# EAGLE design TS (EAGLE 5.11)
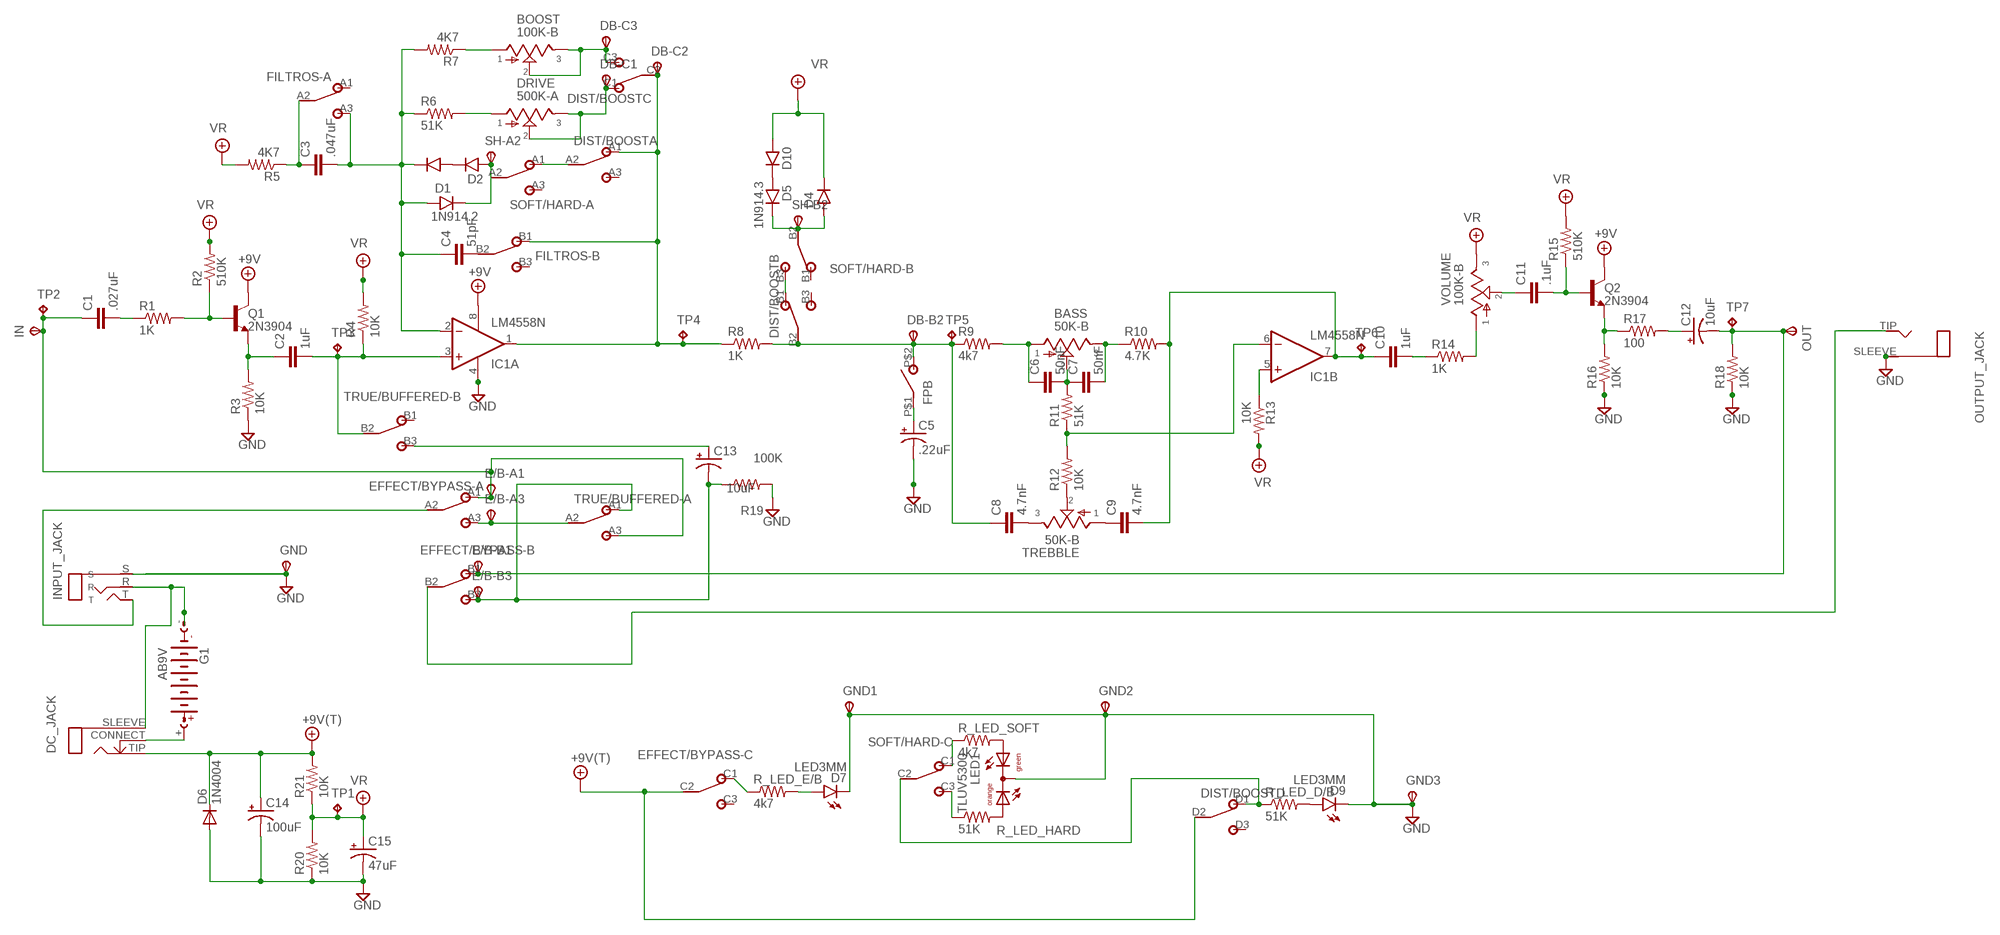
[diagram p0: schematic, sheet 1]

## Parts
+9V1  +9V(T)  [PAD]
+9V2  +9V(T)  [PAD]
BASS  50K-B  PAD_HOLE  [PAD_HOLE]
BOOST  100K-B  PAD_HOLE  [PAD_HOLE]
C1  .027uF  075X0352  [075X035]
C2  1uF  072X0352  [072X035]
C3  .047uF  075X0402  [075X040]
C4  51pF  050X030_0252  [050X030_025_2]
C5  .22uF  044A1  [044A]
C6  50nF  072X0252  [072X025]
C7  50nF  072X0252  [072X025]
C8  4.7nF  072X0252  [072X025]
C9  4.7nF  072X0252  [072X025]
C10  1uF  072X0352  [072X035]
C11  .1uF  072X0352  [072X035]
C12  10uF  0501  [050_020_1]
C13  10uF  0501  [050_020_1]
C14  100uF  0631  [063_025]
C15  47uF  0631  [063_025]
D1  1N914.2  [DO35-2]
D2  1N914.2  [DO35-2]
D3  1N914.2  [DO35-2]
D4  1N914.3  [DO35-3]
D5  1N914.3  [DO35-3]
D6  1N4004  1N400X.3  [DO41-3]
D7  LED3MM  [LED3MM]
D9  LED3MM  [LED3MM]
D10  1N914.3  [DO35-3]
DB-B2  CABLE  [CABLE]
DB-C1  CABLE  [CABLE]
DB-C2  CABLE  [CABLE]
DB-C3  CABLE  [CABLE]
DC_JACK  CLOSEDMONO  [CLOSED_MONO_JACK]
DIST/BOOST  4PDT  [4PDT]
DRIVE  500K-A  PAD_HOLE  [PAD_HOLE]
E/B-A1  CABLE  [CABLE]
E/B-A3  CABLE  [CABLE]
E/B-B1  CABLE  [CABLE]
E/B-B3  CABLE  [CABLE]
EFFECT/BYPASS-  3PDT  [3PDT]
FILTROS-  DPDT  [DPDT]
FPB  SPST  [SPST-PAD]
G1  AB9V  [AB9V]
GND  CABLE  [CABLE]
GND1  CABLE  [CABLE]
GND2  CABLE  [CABLE]
GND3  CABLE  [CABLE]
IC1  LM4558N  [DIL08]
IN  CABLE  [CABLE]
INPUT_JACK  STEREO  [STEREO_JACK]
LED1  TLUV5300  [TLUV5300]
OUT  CABLE  [CABLE]
OUTPUT_JACK  MONO  [MONO_JACK]
Q1  2N3904  [TO92-]
Q2  2N3904  [TO92-]
R1  1K  6MM.3  [R0207/3]
R2  510K  6MM.3  [R0207/3]
R3  10K  6MM.3  [R0207/3]
R4  10K  6MM.3  [R0207/3]
R5  4K7  6MM.3  [R0207/3]
R6  51K  6MM.3  [R0207/3]
R7  4K7  6MM.3  [R0207/3]
R8  1K  6MM.3  [R0207/3]
R9  4k7  6MM.3  [R0207/3]
R10  4.7K  6MM.3  [R0207/3]
R11  51K  6MM.3  [R0207/3]
R12  10K  6MM.3  [R0207/3]
R13  10K  6MM.3  [R0207/3]
R14  1K  6MM.3  [R0207/3]
R15  510K  6MM.3  [R0207/3]
R16  10K  6MM.3  [R0207/3]
R17  100  6MM.3  [R0207/3]
R18  10K  6MM.3  [R0207/3]
R19  100K  6MM.3  [R0207/3]
R20  10K  6MM.3  [R0207/3]
R21  10K  6MM.3  [R0207/3]
R_LED_D/B  51K  6MM.3  [R0207/3]
R_LED_E/B  4k7  6MM.3  [R0207/3]
R_LED_HARD  51K  6MM.3  [R0207/3]
R_LED_SOFT  4k7  6MM.3  [R0207/3]
SH-A2  CABLE  [CABLE]
SH-B2  CABLE  [CABLE]
SOFT/HARD-  3PDT  [3PDT]
TP1  TPTP11R  [TP11R]
TP2  TPTP11R  [TP11R]
TP3  TPTP11R  [TP11R]
TP4  TPTP11R  [TP11R]
TP5  TPTP11R  [TP11R]
TP6  TPTP11R  [TP11R]
TP7  TPTP11R  [TP11R]
TREBBLE  50K-B  PAD_HOLE  [PAD_HOLE]
TRUE/BUFFERED-  DPDT  [DPDT]
VOLUME  100K-B  PAD_HOLE  [PAD_HOLE]

## Nets
+9V: +9V1.P$3(+9V) +9V2.P$3(+9V) C14.+ D6.C DC_JACK.TIP DIST/BOOST.D2 EFFECT/BYPASS-.C2 IC1.8(P:V+) Q1.1(C) Q2.1(C) R21.2
GND: C5.2(-) C14.- C15.- D6.A D7.K(C) D9.K(C) GND1.P$3(PP) GND2.P$3(PP) GND3.P$3(PP) GND.P$3(PP) IC1.4(P:V-) INPUT_JACK.S LED1.CC OUTPUT_JACK.SLEEVE R3.1 R16.1 R18.1 R19.2 R20.1
N$1: D1.C D2.A SH-A2.P$3(PP) SOFT/HARD-.A2
N$2: C3.2 C4.1 D1.A D3.C FILTROS-.A3 IC1.2(A:-IN) R6.1 R7.2
N$3: C4.2 FILTROS-.B2
N$4: DIST/BOOST.A2 SOFT/HARD-.A1
N$5: DIST/BOOST.B1 SOFT/HARD-.B3
N$6: D4.A D5.C SH-B2.P$3(PP) SOFT/HARD-.B2
N$7: C13.+ TRUE/BUFFERED-.B3
N$8: DRIVE.P1 R6.2
N$9: EFFECT/BYPASS-.B2 OUTPUT_JACK.TIP
N$10: IC1.5(B:+IN) R13.1
N$11: C3.1 FILTROS-.A2 R5.1
N$12: R12.1 TREBBLE.P2
N$13: BASS.P2 C6.2 C7.1 R11.2
N$14: C8.2 TREBBLE.P3
N$15: C10.2 R14.1
N$16: R14.2 VOLUME.P1
N$17: C9.1 TREBBLE.P1
N$18: BASS.P1 C6.1 R9.2
N$19: BASS.P3 C7.2 R10.1
N$20: IC1.6(B:-IN) R11.1 R12.2
N$21: C9.2 C10.1 IC1.7(B:OUT) R10.2 TP6.TP
N$22: D2.C D3.A
N$23: C13.- E/B-B3.P$3(PP) EFFECT/BYPASS-.B3 R19.1 TRUE/BUFFERED-.A1
N$24: DC_JACK.CONNECT G1.+
N$25: C2.1 Q1.3(E) R3.2
N$26: R_LED_HARD.1 SOFT/HARD-.C3
N$27: DC_JACK.SLEEVE(RING) G1.- INPUT_JACK.R
N$28: C1.2 R1.1
N$29: Q1.2(B) R1.2 R2.1
N$30: C2.2 IC1.3(A:+IN) R4.1 TP3.TP TRUE/BUFFERED-.B2
N$31: Q2.3(E) R16.2 R17.1
N$32: C11.2 Q2.2(B) R15.1
N$33: C12.+ R17.2
N$34: C11.1 VOLUME.P2
N$35: EFFECT/BYPASS-.A2 INPUT_JACK.T
N$36: LED1.AG R_LED_SOFT.2
N$37: E/B-A3.P$3(PP) EFFECT/BYPASS-.A3 TRUE/BUFFERED-.A2
N$38: C12.- E/B-B1.P$3(PP) EFFECT/BYPASS-.B1 OUT.P$3(PP) R18.2 TP7.TP
N$39: C1.1 E/B-A1.P$3(PP) EFFECT/BYPASS-.A1 IN.P$3(PP) TP2.TP TRUE/BUFFERED-.A3
N$40: EFFECT/BYPASS-.C1 R_LED_E/B.1
N$41: D7.A R_LED_E/B.2
N$42: C5.1(+) FPB.P$1(P)
N$43: LED1.AO R_LED_HARD.2
N$44: D9.A R_LED_D/B.2
N$45: DIST/BOOST.D1 R_LED_D/B.1 SOFT/HARD-.C2
N$46: R_LED_SOFT.1 SOFT/HARD-.C1
N$48: D5.A D10.C
N$49: C8.1 DB-B2.P$3(PP) DIST/BOOST.B2 FPB.P$2(S) R8.2 R9.1 TP5.TP
N$50: DB-C2.P$3(PP) DIST/BOOST.A1 DIST/BOOST.C2 FILTROS-.B1 IC1.1(A:OUT) R8.1 TP4.TP
N$51: BOOST.P1 R7.1
N$52: BOOST.P2 BOOST.P3 DB-C3.P$3(PP) DIST/BOOST.C3
N$53: DB-C1.P$3(PP) DIST/BOOST.C1 DRIVE.P2 DRIVE.P3
VR: C15.+ D4.C D10.A R2.2 R4.2 R5.2 R13.2 R15.2 R20.2 R21.1 TP1.TP VOLUME.P3
Unconnected: DIST/BOOST.A3 DIST/BOOST.B3 DIST/BOOST.D3 EFFECT/BYPASS-.C3 FILTROS-.A1 FILTROS-.B3 SOFT/HARD-.A3 SOFT/HARD-.B1 TRUE/BUFFERED-.B1

## Library data of the parts
+9V1 +9V2 = gm-supply:+9V(T): +9V Voltage Supply use this to hook up +9v throughout a schematic instead of running wire automatically labels the net "+9v" adds a hookup pad to the circuit board
BASS BOOST DRIVE TREBBLE VOLUME = Miguel:PAD_HOLE
C1 = gm-caps-film-chicklet:075X035: 0.027 - 0.033uF Panasonic ECQ-B 7mm x 4mm 50 or 63V: 0.027 - 0.033uF;
C2 C10 C11 = gm-caps-film-box:072X035: 0.15 - 1.0uF; WIMA MKP2 63, 100V: 0.047uF; MKS2 50V: 0.68 - 1.0uF; 63V: 0.33 - 0.47uF; 100V: 0.15 - 0.22uF;
C3 = gm-caps-film-chicklet:075X040: 0.039 - 0.047uF Panasonic ECQ-B 7mm x 4mm 50V: 0.039 - 0.047uF;
C4 = gm-caps-ceramic:050X030_025: 47 - 120pF Xicon Ceramic Disc 2.5mm lead spacing
C5 = gm-caps-tant:044A: .1 - 1.5µF Vishay Sprague Tantalex Long/Short (Case Code A); 4.4mm; 0.1" lead spacing
C6-C9 = gm-caps-film-box:072X025: 1000pF - 0.47uF WIMA MKP2 63, 100V: 1000pF - 0.015uF; MKS2 50V: 0.33 - 0.47uF; 63V: 1000pF - 0.22uF;
C12 C13 = gm-caps-electro-pol:050: 0.22 - 100uF Xicon values at Mouser.com: 10V: 10 - 100uF; 16V: 2.2 - 47uF; 25V: 0.47 - 47uF; 50V: 0.22 - 22uF
C14 C15 = gm-caps-electro-pol:063: 33 - 220uF Xicon values at Mouser.com 10V: 220uF; 16V: 100uF; 25V: 100uF; 50V: 33uF
D1-D5 D10 = gm-diodes:1N914: Fast Switching Diode DO-35 glass case a.k.a. 1N4148
D6 = gm-diodes:1N400X: Rectifier Diodes - often used in power supply to prevent damage from reverse polarization
D7 D9 = gm-diodes:LED
DB-B2 DB-C1-DB-C3 E/B-A1 E/B-A3 E/B-B1 E/B-B3 GND GND1-GND3 IN OUT SH-A2 SH-B2 = Miguel:CABLE
DC_JACK = gm-jacks:CLOSEDMONO: Closed Mono 1/4" Phone Jack
DIST/BOOST = gm-switches:4PDT
EFFECT/BYPASS- SOFT/HARD- = gm-switches:3PDT
FILTROS- TRUE/BUFFERED- = gm-switches:DPDT
FPB = gm-switches:SPST
G1 = gm-supply:AB9V: 9-V BATTERY CLIP
IC1 = gm-ics:*4558: *4558 Op Amp Infamous for its use in tube screamers. This op amp has many manufacturers, hence the leading "*" in the name. The JRC4558 is a widely used example.
INPUT_JACK = gm-jacks:STEREO: Stereo (TRS) 1/4" Phone Jack often use for the input jack to disconnect battery when there is no plug in the jack also called TRS or tip-ring-sleeve jack
LED1 = led:TLUV5300: Bicolor LED 5 mm Untinted Diffused Package Source: www.vishay.com .. Bi-Color LED Vashay TLUV5300.pdf
OUTPUT_JACK = gm-jacks:MONO: Mono 1/4" Phone Jack
Q1 Q2 = gm-trans:2N3904: NPN Transistor
R1-R21 R_LED_D/B R_LED_E/B R_LED_HARD R_LED_SOFT = gm-resistors:6MM: 6mm Resistors Leads spaced 1-6 holes apart for 0.1" perfboard. Suitable for 1/4 watt resistors.
TP1-TP7 = testpad:TP: Test pad

## Board
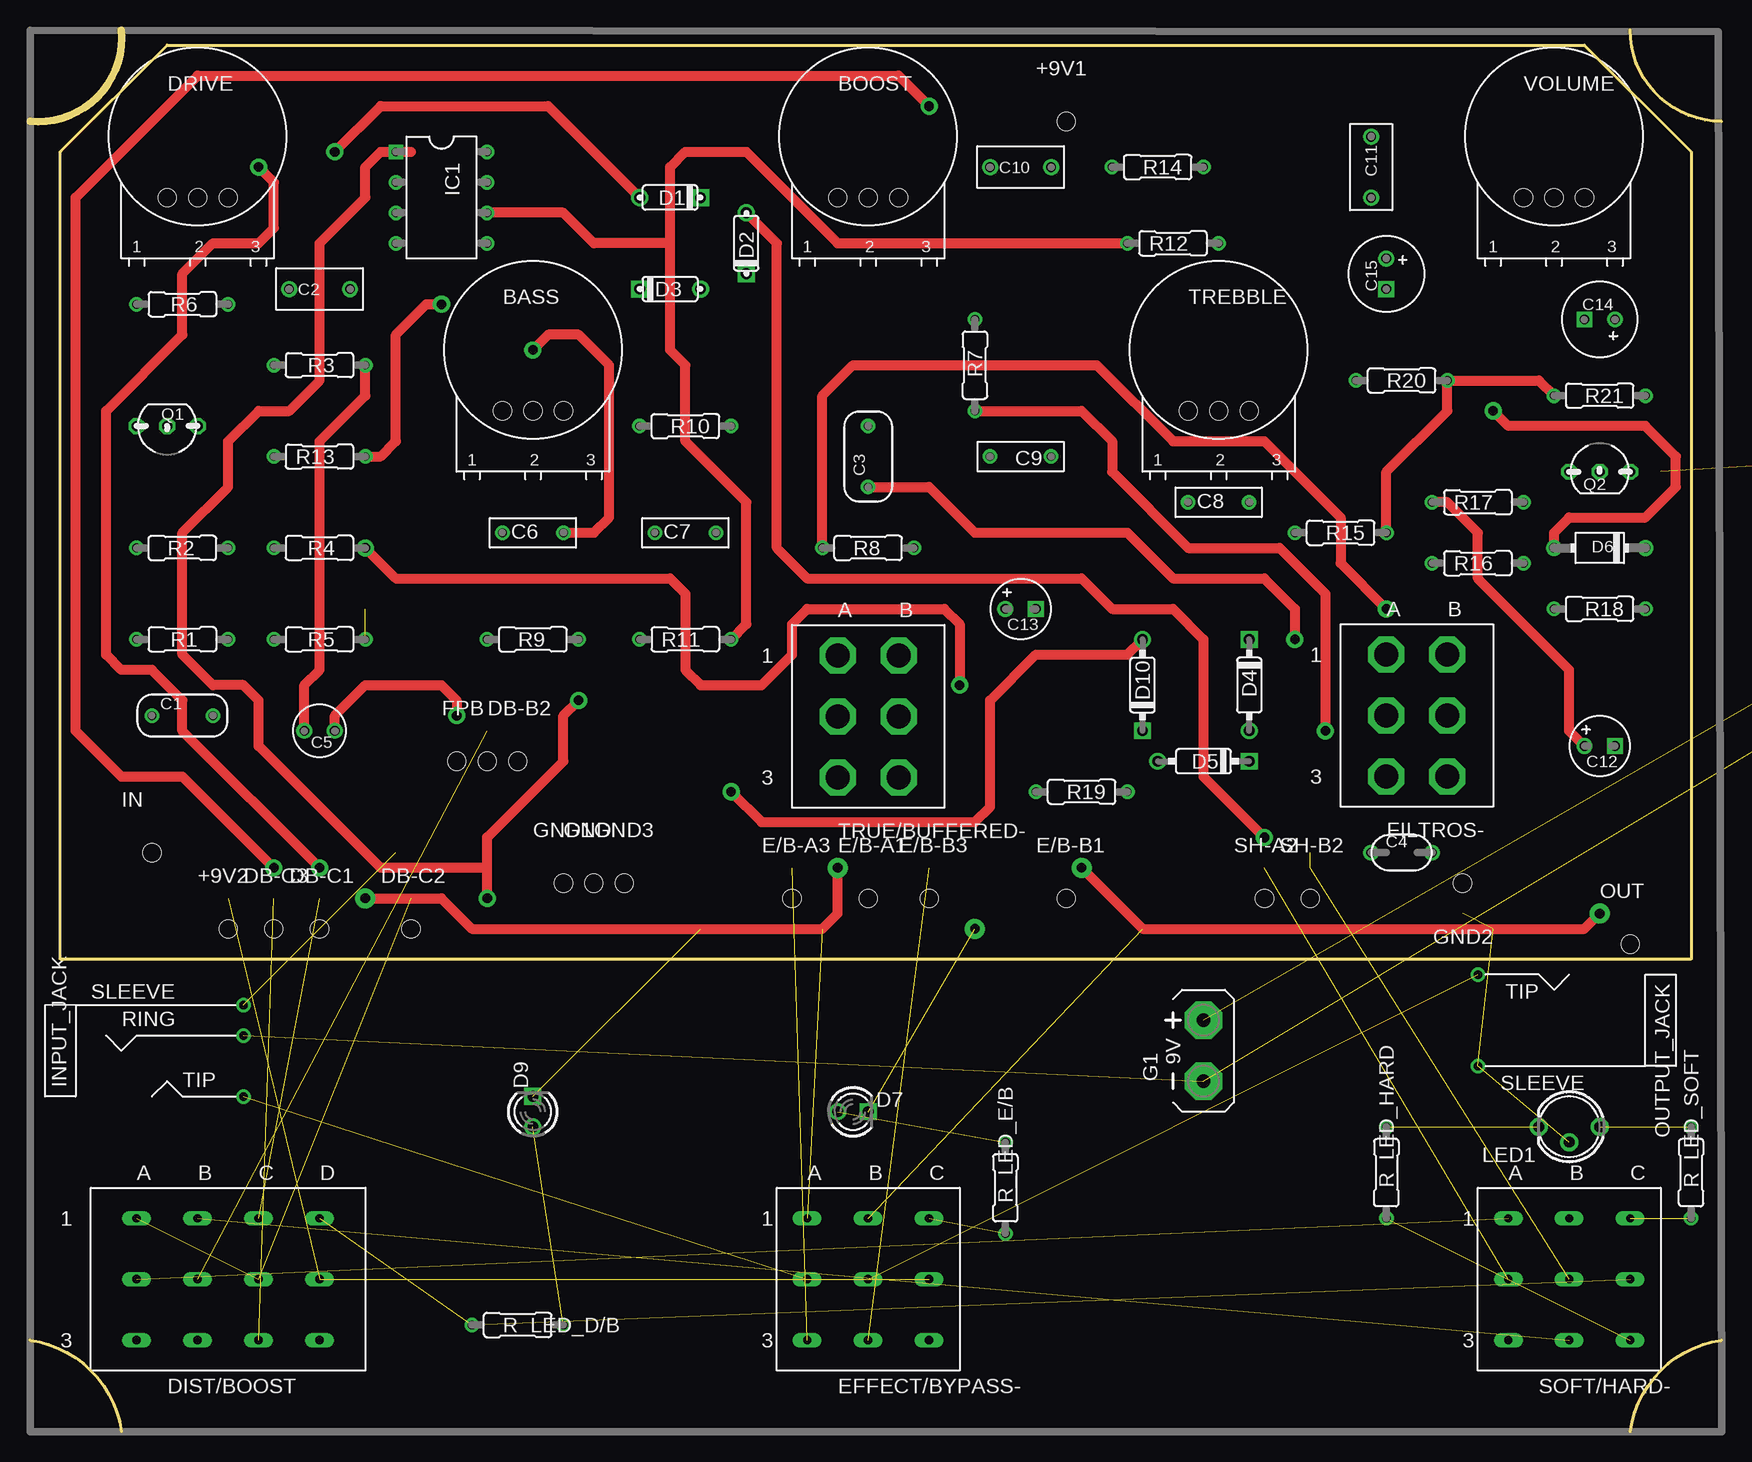
[diagram p1: board, top side]
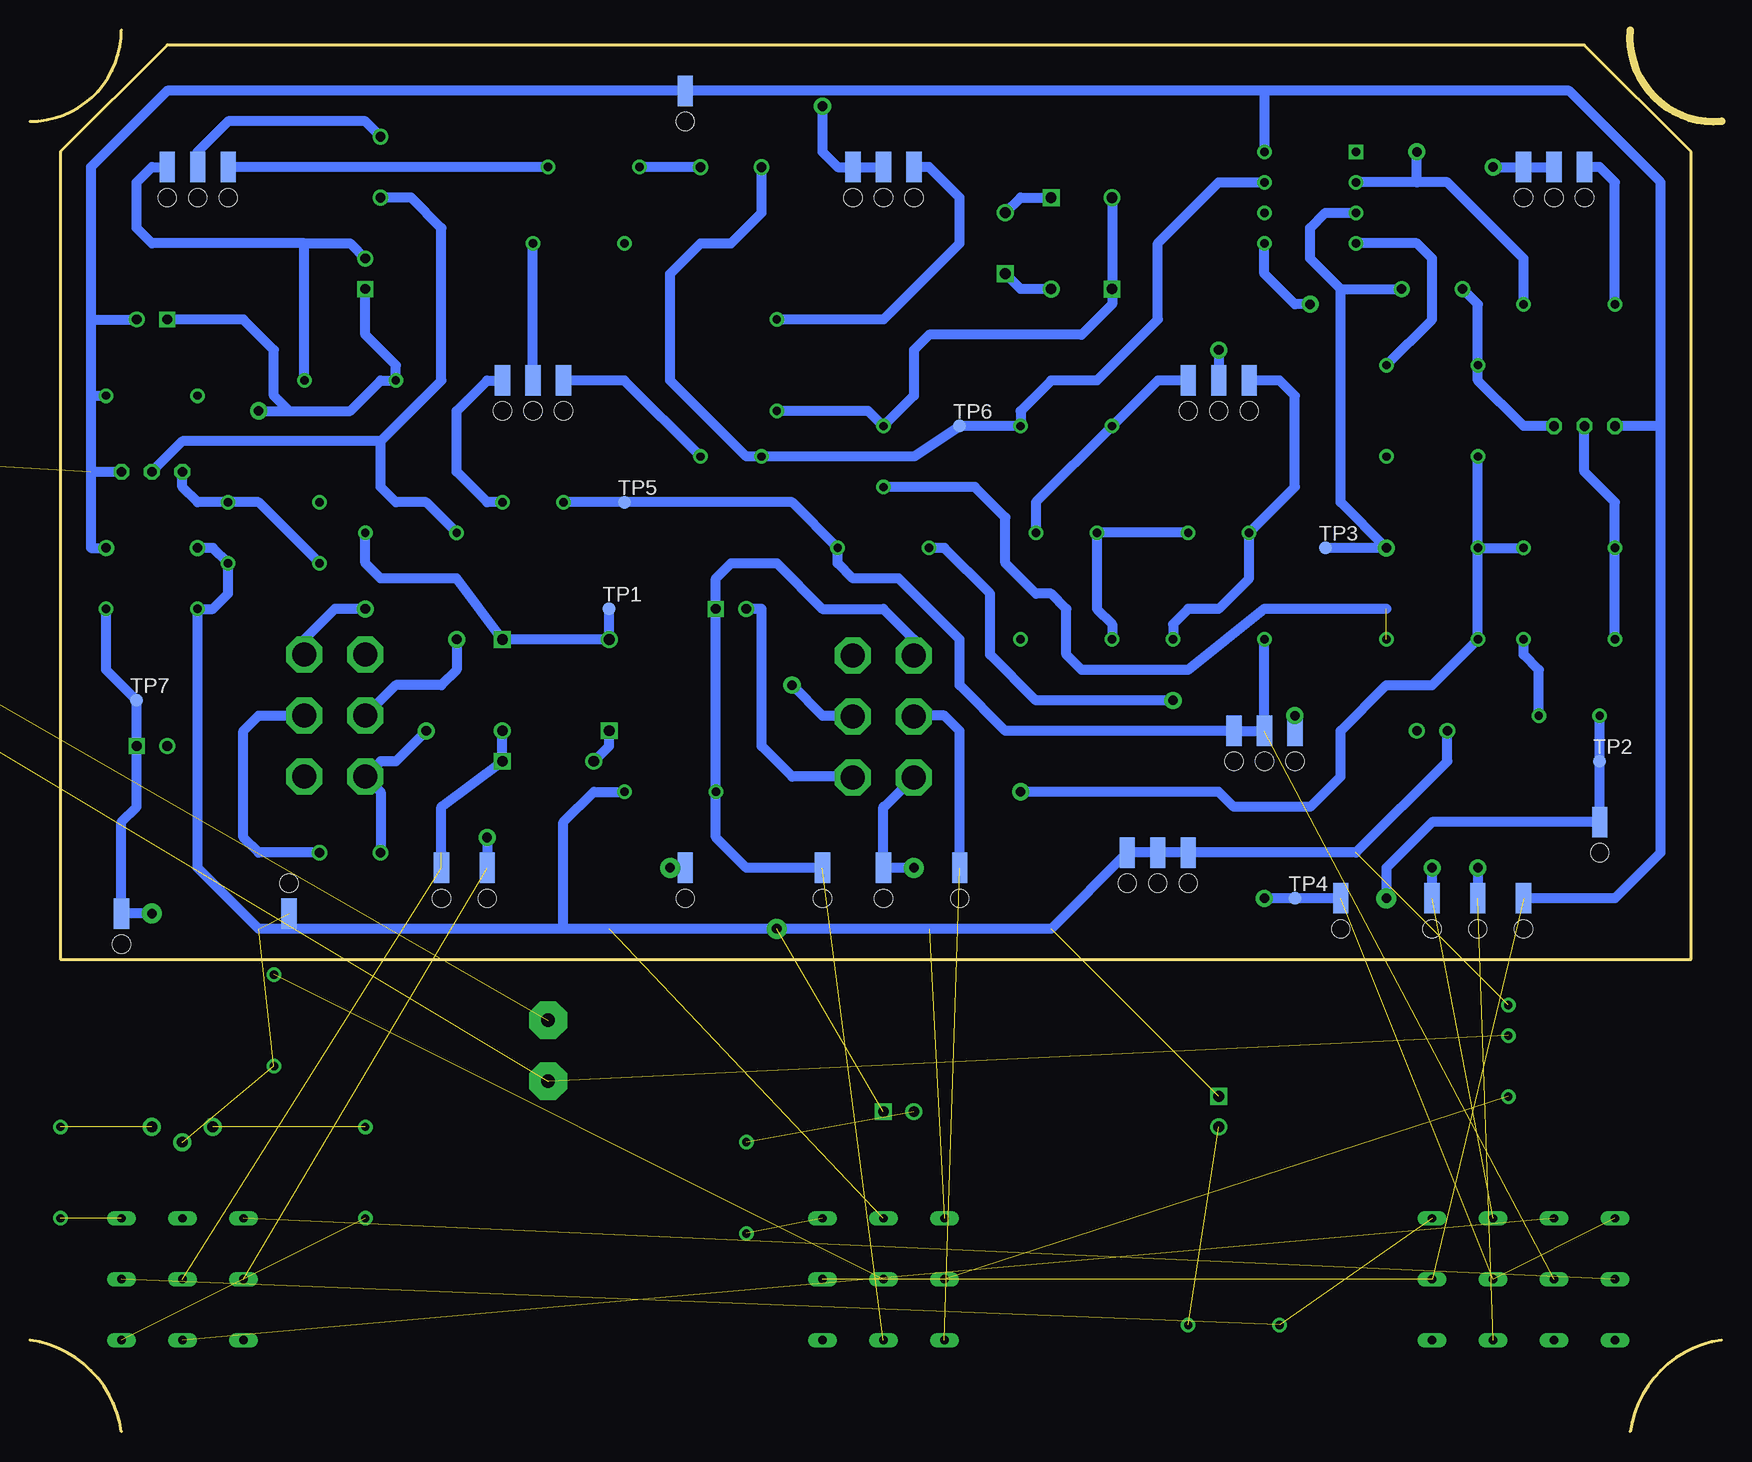
[diagram p2: board, bottom side, seen from below]

Size 140.97 x 116.84 mm. Coordinates in mm from the lower left corner, seen from the top.
Outline: 7.62,116.84 arc-100 0,109.22
Outline: 140.97,109.22 arc-90 133.35,116.84
Outline: 0,7.62 arc-74 7.62,0
Outline: 133.35,0 arc-74 140.97,7.62
Outline: 2.54,39.37 2.54,106.68 11.43,115.57 129.54,115.57 138.43,106.68 138.43,39.37 2.54,39.37
Copper layers (1*16): Top 0.035mm / dielectric 1.5mm / Bottom 0.035mm
Design rules "default": minimum track width 10mil, minimum drill 24mil, track to track 8mil, track to pad 8mil, pad to pad 8mil, via to via 8mil, smd to smd 8mil, copper to edge 40mil, drill to drill 8mil, minimum pad ring 10mil, minimum via ring 8mil, stop-mask expansion 4mil, vias tented up to drill 0mil, thermal gap 10mil

### Footprints (pad centres in the part's own frame; a part is rotated, then mirrored left to right if it is on the bottom)
PAD = smd 1.27 x 2.54 bottom: P$3 0,2.54 | hole 1.5: 0,0
PAD_HOLE = smd 1.27 x 2.54 bottom: P1 -2.54,-2.54; P2 0,-2.54; P3 2.54,-2.54 | hole 1.5: -2.54,-5.08; 0,-5.08; 2.54,-5.08
075X035 = drill 0.7 round: 1 -2.54,0; 2 2.54,0
072X035 = drill 0.813 round: 1 -2.54,0; 2 2.54,0
075X040 = drill 0.7 round: 1 -2.54,0; 2 2.54,0
050X030_025_2 = drill 0.8 round: 1 -2.54,0; 2 2.54,0
044A = drill 0.8 round: 1 -1.27,0; 2 1.27,0
072X025 = drill 0.7 round: 1 -2.54,0; 2 2.54,0
050_020_1 = drill 0.813 round: + -1.27,0 | drill 0.813 square: - 1.27,0
063_025 = drill 0.813 round: + -1.27,0 | drill 0.813 square: - 1.27,0
DO35-2 = drill 0.9 round: A 2.54,0 | drill 0.9 square: C -2.54,0
DO35-3 = drill 0.9 round: A 3.81,0 | drill 0.9 square: C -3.81,0
DO41-3 = drill 0.8 round: A 3.81,0; C -3.81,0
LED3MM = drill 0.9 round: A -1.27,0 | drill 0.9 square: K 1.27,0
CABLE = smd 1.27 x 2.54 bottom: P$3 0,2.54 | hole 1.5: 0,0
CLOSED_MONO_JACK = drill 0.7 round: CONNECT 7.62,-1.27; SLEEVE 7.62,3.81; TIP 7.62,-3.81
4PDT = drill 0.7 long: A1 -7.62,5.08; A2 -7.62,0; A3 -7.62,-5.08; B1 -2.54,5.08; B2 -2.54,0; B3 -2.54,-5.08; C1 2.54,5.08; C2 2.54,0; C3 2.54,-5.08; D1 7.62,5.08; D2 7.62,0; D3 7.62,-5.08
3PDT = drill 0.7 long: A1 -5.08,5.08; A2 -5.08,0; A3 -5.08,-5.08; B1 0,5.08; B2 0,0; B3 0,-5.08; C1 5.08,5.08; C2 5.08,0; C3 5.08,-5.08
DPDT = drill 2 octagon: A1 -2.54,5.08; A2 -2.54,0; A3 -2.54,-5.08; B1 2.54,5.08; B2 2.54,0; B3 2.54,-5.08
SPST-PAD = smd 1.27 x 2.54 bottom: P$1 -2.54,2.54; P$2 0,2.54 | hole 1.5: -2.54,0; 0,0
AB9V = drill 1.118 pad 3.15 octagon: + 0,2.54; - 0,-2.54
DIL08 = drill 0.7 square: 1 -3.81,-3.81 | drill 0.7 round: 2 -1.27,-3.81; 3 1.27,-3.81; 4 3.81,-3.81; 5 3.81,3.81; 6 1.27,3.81; 7 -1.27,3.81; 8 -3.81,3.81
STEREO_JACK = drill 0.7 round: R -7.62,-1.27; S -7.62,-3.81; T -7.62,3.81
TLUV5300 = drill 0.9 pad 1.5 round: AG 2.54,0; AO -2.54,0; CC 0,-1.27
MONO_JACK = drill 0.7 round: SLEEVE -7.62,-3.81; TIP -7.62,3.81
TO92- = drill 0.813 octagon: 1 2.54,0; 2 0,0; 3 -2.54,0
R0207/3 = drill 0.7 round: 1 -3.81,0; 2 3.81,0
TP11R = smd 1.1 x 1.1: TP 0,0

### Placement (x,y rotation side)
+9V1  86.36,109.22 0 top
+9V2  16.51,41.91 0 top
BASS  41.91,90.17 0 top
BOOST  69.85,107.95 0 top
C1  12.7,59.69 0 top
C2  24.13,95.25 0 top
C3  69.85,81.28 90 top
C4  114.3,48.26 0 top
C5  24.13,58.42 180 top
C6  41.91,74.93 0 top
C7  54.61,74.93 0 top
C8  4.7pF  [072X025]  99.06,77.47 0 top
C9  4.7pF  [072X025]  82.55,81.28 180 top
C10  82.55,105.41 0 top
C11  111.76,105.41 270 top
C12  130.81,57.15 0 top
C13  82.55,68.58 0 top
C14  130.81,92.71 180 top
C15  113.03,96.52 270 top
D1  53.34,102.87 180 top
D2  59.69,99.06 90 top
D3  53.34,95.25 0 top
D4  101.6,62.23 270 top
D5  97.79,55.88 180 top
D6  130.81,73.66 180 top
D7  68.58,26.67 0 top
D9  41.91,26.67 90 top
D10  92.71,62.23 90 top
DB-B2  40.64,55.88 0 top
DB-C1  24.13,41.91 0 top
DB-C2  31.75,41.91 0 top
DB-C3  20.32,41.91 0 top
DC_JACK  182.88,90.17 270 top  (outside the outline)
DIST/BOOST  16.51,12.7 0 top
DRIVE  13.97,107.95 0 top
E/B-A1  69.85,44.45 0 top
E/B-A3  63.5,44.45 0 top
E/B-B1  86.36,44.45 0 top
E/B-B3  74.93,44.45 0 top
EFFECT/BYPASS-  69.85,12.7 0 top
FILTROS-  115.57,59.69 0 top
FPB  38.1,55.88 0 top
G1  97.79,31.75 0 top
GND  46.99,45.72 0 top
GND1  44.45,45.72 0 top
GND2  119.38,45.72 180 top
GND3  49.53,45.72 0 top
IC1  34.29,102.87 270 top
IN  10.16,48.26 0 top
INPUT_JACK  10.16,31.75 180 top
LED1  128.27,25.4 0 top
OUT  133.35,40.64 0 top
OUTPUT_JACK  128.27,34.29 0 top
Q1  11.43,83.82 180 top
Q2  130.81,80.01 0 top
R1  12.7,66.04 180 top
R2  12.7,73.66 0 top
R3  24.13,88.9 180 top
R4  24.13,73.66 180 top
R5  24.13,66.04 180 top
R6  12.7,93.98 180 top
R7  78.74,88.9 270 top
R8  69.85,73.66 0 top
R9  41.91,66.04 0 top
R10  54.61,83.82 0 top
R11  54.61,66.04 180 top
R12  95.25,99.06 180 top
R13  24.13,81.28 180 top
R14  93.98,105.41 0 top
R15  109.22,74.93 0 top
R16  120.65,72.39 180 top
R17  120.65,77.47 180 top
R18  130.81,68.58 0 top
R19  87.63,53.34 0 top
R20  114.3,87.63 0 top
R21  130.81,86.36 0 top
R_LED_D/B  40.64,8.89 0 top
R_LED_E/B  81.28,20.32 90 top
R_LED_HARD  113.03,21.59 90 top
R_LED_SOFT  138.43,21.59 90 top
SH-A2  102.87,44.45 0 top
SH-B2  106.68,44.45 0 top
SOFT/HARD-  128.27,12.7 0 top
TP1  92.71,68.58 0 bottom
TP2  10.16,55.88 0 bottom
TP3  33.02,73.66 0 bottom
TP4  35.56,44.45 0 bottom
TP5  91.44,77.47 0 bottom
TP6  63.5,83.82 0 bottom
TP7  132.08,60.96 0 bottom
TREBBLE  99.06,90.17 0 top
TRUE/BUFFERED-  69.85,59.62 0 top
VOLUME  127,107.95 0 top

### Tracks (layer width: path | path; a pad name or v marks a point on that pad's centre or on a via)
+9V  (3 unrouted)
  Bottom 0.813: 5.08,83.82 5.08,48.26 8.89,44.45 +9V2.P$3 | 5.08,83.82 5.08,104.14 12.7,111.76 38.1,111.76 | 38.1,111.76 +9V1.P$3 129.54,111.76 135.89,105.41 135.89,92.71 | 5.08,83.82 Q1.1 | 38.1,111.76 IC1.8 | 135.89,92.71 135.89,86.36 | 135.89,86.36 135.89,80.01 | 135.89,80.01 135.89,73.66 D6.C | 135.89,92.71 C14.+ | 135.89,86.36 R21.2 | 135.89,80.01 Q2.1
GND  (via drill 0.8 pad 1.42, 0.8 pad 1.68)  (6 unrouted)
  Top 0.813: R3.1 27.94,86.36 24.13,82.55 24.13,63.5 22.86,62.23 C5.2 | v121.92,85.09 123.19,83.82 134.62,83.82 137.16,81.28 137.16,78.74 134.62,76.2 128.27,76.2 127,74.93 D6.A
  Bottom 0.813: 96.52,41.91 121.92,41.91 127,46.99 R18.1 125.73,68.58 124.46,69.85 R16.1 125.73,73.66 D6.A | R19.2 93.98,53.34 96.52,50.8 96.52,41.91 | C5.2 22.86,55.88 30.48,48.26 GND1.P$3 GND.P$3 GND3.P$3 55.88,41.91 v78.74,41.91 96.52,41.91 | IC1.4 25.4,99.06 24.13,97.79 24.13,92.71 R3.1 | C15.- 113.03,91.44 110.49,88.9 R20.1 111.76,87.63 114.3,85.09 119.38,85.09 | 119.38,85.09 120.65,86.36 120.65,90.17 123.19,92.71 C14.- | v121.92,85.09 119.38,85.09
N$1  (via drill 0.8 pad 1.42)  (1 unrouted)
  Top 0.813: v102.87,49.53 97.79,54.61 97.79,66.04 95.25,68.58 90.17,68.58 87.63,71.12 64.77,71.12 62.23,73.66 62.23,99.06 D2.A
  Bottom 0.813: D2.A 58.42,102.87 D1.C | v102.87,49.53 SH-A2.P$3
N$2  (via drill 0.8 pad 1.42)
  Top 0.813: D1.A 43.18,110.49 29.21,110.49 v25.4,106.68 | v107.95,58.42 107.95,69.85 104.14,73.66 96.52,73.66 90.17,80.01 90.17,82.55 87.63,85.09 R7.2
  Bottom 0.813: R6.1 16.51,97.79 22.86,104.14 25.4,104.14 | 25.4,104.14 IC1.2 | 25.4,104.14 v25.4,106.68 | D1.A D3.C 50.8,93.98 53.34,91.44 66.04,91.44 67.31,90.17 67.31,86.36 C3.2 71.12,85.09 R7.2 | C4.1 111.76,53.34 FILTROS-.A3 111.76,55.88 110.49,55.88 v107.95,58.42
N$3
  Bottom 0.813: C4.2 121.92,48.26 123.19,49.53 123.19,58.42 121.92,59.69 FILTROS-.B2
N$4  (1 unrouted)
N$5  (1 unrouted)
N$6  (2 unrouted)
  Bottom 0.813: 106.68,48.26 106.68,52.07 D5.C D4.A
N$7
  Bottom 0.813: C13.+ 80.01,68.58 80.01,57.15 77.47,54.61 72.46,54.61 TRUE/BUFFERED-.B3 72.39,54.61
N$8
  Bottom 0.813: DRIVE.P1 10.16,105.41 8.89,104.14 R6.2
N$9  (1 unrouted)
N$10  (via drill 0.8 pad 1.42)
  Top 0.813: v34.29,93.98 33.02,93.98 30.48,91.44 30.48,82.55 29.21,81.28 R13.1
  Bottom 0.813: IC1.5 38.1,96.52 35.56,93.98 v34.29,93.98
N$11  (via drill 0.8 pad 1.42)  (1 unrouted)
  Top 0.813: v105.41,66.04 105.41,68.58 102.87,71.12 95.25,71.12 91.44,74.93 78.74,74.93 74.93,78.74 C3.1
  Bottom 0.813: FILTROS-.A2 110.49,62.23 106.68,62.23 105.41,63.5 v105.41,66.04 | C3.1 62.23,78.74 59.69,76.2 59.69,72.39 57.15,69.85 55.88,69.85 54.61,68.58 54.61,64.77 53.34,63.5 44.45,63.5 38.1,68.58 27.94,68.58
N$12
  Bottom 0.813: TREBBLE.P2 R12.1
N$13  (via drill 0.8 pad 1.42)
  Top 0.813: v41.91,90.17 43.18,91.44 45.72,91.44 48.26,88.9 48.26,76.2 46.99,74.93 C6.2
  Bottom 0.813: v41.91,90.17 BASS.P2 | C6.2 C7.1 52.07,68.58 50.8,67.31 R11.2
N$14
  Bottom 0.813: TREBBLE.P3 102.87,87.63 105.41,85.09 105.41,80.01 102.87,77.47 C8.2
N$15
  Bottom 0.813: C10.2 R14.1
N$16
  Bottom 0.813: R14.2 VOLUME.P1
N$17
  Bottom 0.813: TREBBLE.P1 91.44,87.63 C9.1
N$18
  Bottom 0.813: BASS.P1 36.83,87.63 35.56,86.36 35.56,78.74 C6.1 39.37,71.12 41.91,68.58 44.45,68.58 45.72,67.31 R9.2
N$19
  Bottom 0.813: BASS.P3 46.99,87.63 R10.1 57.15,77.47 C7.2
N$20
  Top 0.813: R12.2 67.31,99.06 59.69,106.68 54.61,106.68 53.34,105.41 53.34,99.06 | 53.34,99.06 53.34,90.17 54.61,88.9 54.61,82.55 59.69,77.47 59.69,67.31 R11.1 | IC1.6 44.45,101.6 46.99,99.06 53.34,99.06
N$21
  Bottom 0.813: IC1.7 41.91,104.14 46.99,99.06 46.99,92.71 52.07,87.63 55.88,87.63 58.42,85.09 R10.2 TP6.TP 67.31,81.28 C9.2 81.28,81.28 87.63,87.63 87.63,96.52 85.09,99.06 82.55,99.06 80.01,101.6 C10.1
N$22
  Bottom 0.813: D3.A 58.42,95.25 D2.C
N$23  (1 unrouted)
  Bottom 0.813: TRUE/BUFFERED-.A1 67.31,66.04 69.85,68.58 74.93,68.58 78.74,72.39 82.55,72.39 83.82,71.12 C13.- R19.1 83.82,49.53 81.28,46.99 E/B-B3.P$3
N$24  (1 unrouted)
N$25
  Bottom 0.813: Q1.3 16.51,83.82 20.32,87.63 R3.2 20.32,93.98 C2.1
N$26  (1 unrouted)
N$27  (2 unrouted)
N$28
  Bottom 0.813: C1.2 15.24,63.5 16.51,64.77 R1.1
N$29
  Bottom 0.813: R1.2 R2.1 8.89,77.47 11.43,80.01 Q1.2
N$30  (via drill 0.8 pad 1.42)
  Top 0.813: R4.1 30.48,71.12 53.34,71.12 54.61,69.85 54.61,63.5 55.88,62.23 60.96,62.23 63.5,64.77 63.5,67.31 64.77,68.58 76.2,68.58 77.47,67.31 v77.47,62.23
  Bottom 0.813: 31.75,95.25 C2.2 | 31.75,95.25 34.29,97.79 34.29,100.33 33.02,101.6 IC1.3 | 31.75,95.25 31.75,77.47 R4.1 TP3.TP | TRUE/BUFFERED-.B2 72.39,59.69 74.93,59.69 v77.47,62.23
  other vias: 27.94,73.66
N$31
  Bottom 0.813: Q2.3 128.27,78.74 127,77.47 R17.1 121.92,77.47 R16.2
N$32
  Bottom 0.813: Q2.2 128.27,82.55 111.76,82.55 | C11.2 109.22,102.87 106.68,100.33 106.68,87.63 111.76,82.55 | R15.1 107.95,77.47 110.49,77.47 111.76,78.74 111.76,82.55
N$33
  Top 0.813: C12.+ 128.27,58.42 128.27,63.5 120.65,71.12 120.65,74.93 118.11,77.47 R17.2
N$34
  Bottom 0.813: C11.1 113.03,109.22 124.46,109.22 127,106.68 VOLUME.P2
N$35  (1 unrouted)
N$36  (1 unrouted)
N$37  (1 unrouted)
  Bottom 0.813: TRUE/BUFFERED-.A2 67.24,59.69 64.77,59.69 63.5,58.42 E/B-A3.P$3
N$38  (via drill 0.8 pad 1.68)  (1 unrouted)
  Top 0.813: v87.63,46.99 92.71,41.91 129.54,41.91 v130.81,43.18
  Bottom 0.813: R18.2 134.62,63.5 TP7.TP C12.- 132.08,52.07 133.35,50.8 OUT.P$3 v130.81,43.18 | E/B-B1.P$3 v87.63,46.99
N$39  (via drill 0.8 pad 1.68)  (1 unrouted)
  Top 0.813: v27.94,44.45 34.29,44.45 36.83,41.91 66.04,41.91 67.31,43.18 v67.31,46.99
  Bottom 0.813: C1.1 TP2.TP IN.P$3 24.13,50.8 27.94,46.99 v27.94,44.45 | TRUE/BUFFERED-.A3 69.78,52.07 69.85,52.07 E/B-A1.P$3 v67.31,46.99
N$40  (1 unrouted)
N$41  (1 unrouted)
N$42  (via drill 0.8 pad 1.42)
  Top 0.813: C5.1 25.4,59.69 27.94,62.23 34.29,62.23 35.56,60.96 v35.56,59.69
  Bottom 0.813: v35.56,59.69 FPB.P$1
N$43  (1 unrouted)
N$44  (1 unrouted)
N$45  (2 unrouted)
N$46  (1 unrouted)
N$47
  pour Bottom: 20.32,72.39 19.05,73.66 20.32,74.93
N$48
  Bottom 0.813: D5.A 92.71,57.15 D10.C
N$49  (1 unrouted)
  Bottom 0.813: R9.1 FPB.P$2 DB-B2.P$3 59.69,58.42 63.5,62.23 63.5,66.04 68.58,71.12 72.39,71.12 73.66,72.39 R8.2 77.47,77.47 TP5.TP C8.1
N$50  (via drill 0.8 pad 1.42)  (2 unrouted)
  Top 0.813: v113.03,68.58 109.22,72.39 109.22,76.2 102.87,82.55 95.25,82.55 88.9,88.9 68.58,88.9 66.04,86.36 R8.1 | 31.75,106.68 IC1.1 29.21,106.68 27.94,105.41 27.94,102.87 24.13,99.06 24.13,87.63 21.59,85.09 19.05,85.09 16.51,82.55 16.51,78.74 12.7,74.93 12.7,64.77 15.24,62.23 17.78,62.23 19.05,60.96 19.05,57.15 29.21,46.99 38.1,46.99 | v45.72,60.96 44.45,59.69 44.45,55.88 38.1,49.53 38.1,46.99 | v38.1,44.45 38.1,46.99
  Bottom 0.813: FILTROS-.B1 118.11,66.04 115.57,68.58 v113.03,68.58 | R8.1 64.77,73.66 60.96,69.85 60.96,64.77 57.15,60.96 v45.72,60.96 | v38.1,44.45 TP4.TP DB-C2.P$3
N$51
  Bottom 0.813: BOOST.P1 66.04,105.41 63.5,102.87 63.5,99.06 69.85,92.71 R7.1
N$52  (via drill 0.8 pad 1.42)  (1 unrouted)
  Top 0.813: v20.32,46.99 12.7,54.61 7.62,54.61 3.81,58.42 3.81,102.87 13.97,113.03 72.39,113.03 v74.93,110.49
  Bottom 0.813: BOOST.P2 BOOST.P3 73.66,105.41 74.93,106.68 v74.93,110.49 | v20.32,46.99 DB-C3.P$3
N$53  (via drill 0.8 pad 1.42)  (1 unrouted)
  Top 0.813: v19.05,105.41 20.32,104.14 20.32,100.33 19.05,99.06 15.24,99.06 12.7,96.52 12.7,91.44 6.35,85.09 6.35,64.77 7.62,63.5 10.16,63.5 12.7,60.96 12.7,58.42 v24.13,46.99
  Bottom 0.813: DRIVE.P2 DRIVE.P3 v19.05,105.41 | DB-C1.P$3 v24.13,46.99
N$54  (via drill 0.8 pad 1.42)
  other vias: 102.87,49.53
N$55  (via drill 0.8 pad 1.68)
  other vias: 130.81,43.18
N$56  (via drill 0.8 pad 1.68)
  other vias: 87.63,46.99
N$57
  pour Bottom: 36.83,111.76 38.1,110.49 39.37,111.76 38.1,111.76
N$58
  pour Bottom: 6.35,83.82 5.08,85.09 5.08,82.55
N$66  (via drill 0.8)
  other vias: 41.91,90.17
VR  (via drill 0.8 pad 1.42)
  Top 0.813: v58.42,53.34 60.96,50.8 78.74,50.8 80.01,52.07 80.01,60.96 83.82,64.77 91.44,64.77 D10.A | R21.1 125.73,87.63 R20.2 118.11,85.09 113.03,80.01 R15.2
  Bottom 0.813: R4.2 R2.2 | R4.2 R13.2 | R4.2 R5.2 24.13,62.23 27.94,62.23 31.75,58.42 31.75,54.61 34.29,52.07 40.64,52.07 41.91,53.34 v58.42,53.34 | VOLUME.P3 130.81,105.41 132.08,104.14 132.08,100.33 130.81,99.06 118.11,99.06 | 118.11,99.06 114.3,99.06 C15.+ | R20.2 118.11,99.06 | R15.2 113.03,72.39 111.76,71.12 105.41,71.12 D4.C D10.A TP1.TP